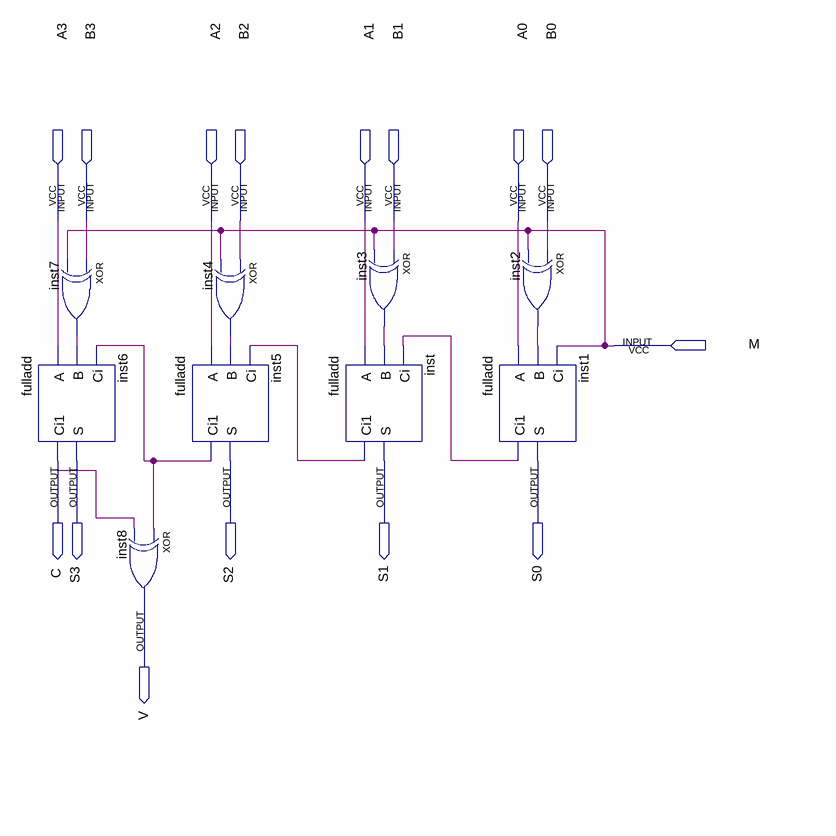
[diagram p0: schematic sheet]
// Quartus schematic 4bit_adder.bdf as structural Verilog: 9 symbols, 15 pins
module \4bit_adder  (
  input  A3,
  input  B3,
  input  A2,
  input  B2,
  input  A1,
  input  B1,
  input  A0,
  input  B0,
  input  M,
  output C,
  output S3,
  output S2,
  output S1,
  output S0,
  output V
);

  wire inst1_ci1, inst2_out, inst3_out, inst4_out, inst5_ci1, inst7_out, inst_ci1;

  xor inst7 (inst7_out, B3, M);
  fulladd inst6 (.A(A3), .B(inst7_out), .Ci(inst5_ci1), .Ci1(C), .S(S3));
  xor inst8 (V, inst5_ci1, C);
  xor inst4 (inst4_out, B2, M);
  fulladd inst5 (.A(A2), .B(inst4_out), .Ci(inst_ci1), .Ci1(inst5_ci1), .S(S2));
  xor inst3 (inst3_out, B1, M);
  fulladd inst (.A(A1), .B(inst3_out), .Ci(inst1_ci1), .Ci1(inst_ci1), .S(S1));
  xor inst2 (inst2_out, B0, M);
  fulladd inst1 (.A(A0), .B(inst2_out), .Ci(M), .Ci1(inst1_ci1), .S(S0));
endmodule
